# Altium project master-010106.PrjPcb (part 1 of 3)
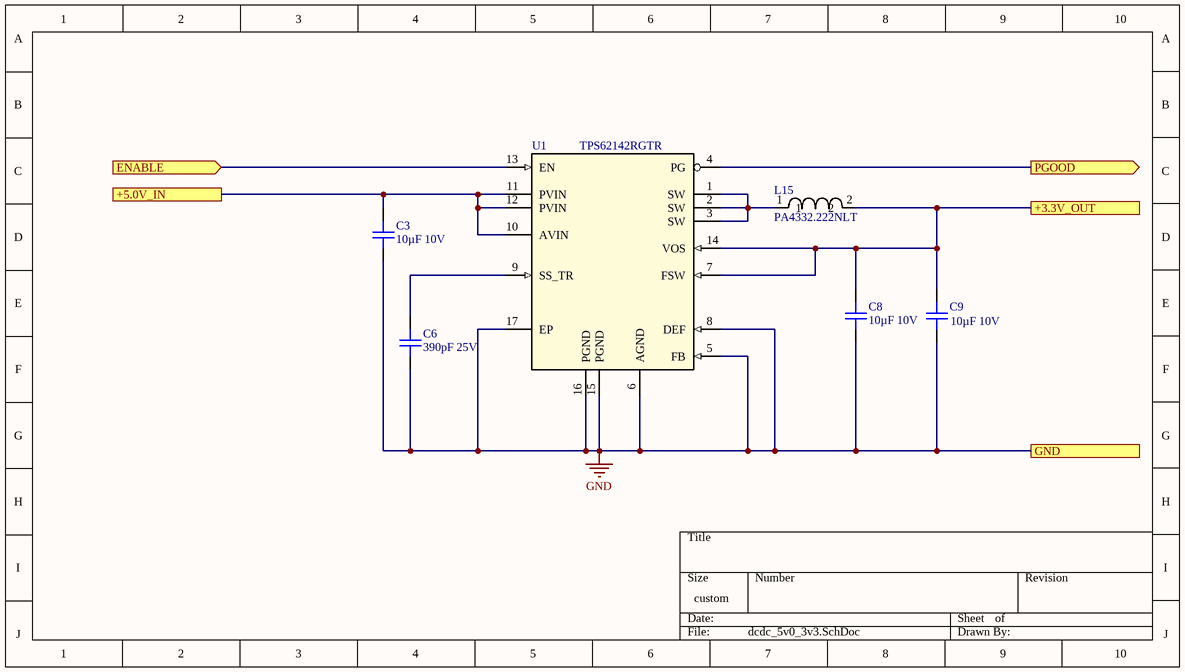
[diagram p0: dcdc_5v0_3v3.SchDoc]
GlobalDate: 2020-01-10; GlobalLicense: Creative Commons Attribution 4.0; GlobalProject: foxBMS BMS-master; GlobalVersion: 1.0.6-2
18 sheets, 274 parts. Net scope: hierarchical (ports join the sheet entries above them; power ports are global).
Board files: master.PcbDoc, master-1X1.PcbDoc
Sheets:
  dcdc_5v0_3v3.SchDoc
  hierarchy.SchDoc
    U_17_FPGA_SPI_interface = FPGA_SPI_interface.SchDoc
    U_04_mcu0_primary = mcu0_primary.SchDoc
      U_0404_debug_LED = debug_LED.SchDoc
      U_0405_ext_bootload_activation = ext_bootload_activation.SchDoc
      U_0400_power = power.SchDoc
    U_06_mcu0_to_mcu1_isolated_SPI = mcu0_to_mcu1_isolated_SPI.SchDoc
    U_13_isolated_USB = isolated_USB.SchDoc
    U_05_mcu1_secondary = mcu1_secondary.SchDoc
    U_18_connector_to_BMS_extension = connector_to_BMS_extension.SchDoc
    U_09_interlock_circuit = interlock_circuit.SchDoc
    U_10_contactor_control = contactor_control.SchDoc
    U_07_isolated_rs485 = isolated_rs485.SchDoc
  dcdc_wide_3v3.SchDoc
  bms-slave-magnetics.SchDoc
  0301_LTC6820_chip.SchDoc
  IsoDcDc-BSR033A.SchDoc

## Sheet dcdc_5v0_3v3.SchDoc
size 220 x 124 mm; SheetNumber: 1; SheetTotal: 1

### Parts
C3  10µF 10V  [0805C]
C6  390pF 25V  [0402C]
C8  10µF 10V  [0805C]
C9  10µF 10V  [0805C]
L15  PA4332.222NLT  [PA4332]
U1  TPS62142RGTR  [RGT0016C]

### Ports
+3.3V_OUT, +5.0V_IN, ENABLE (in), GND, PGOOD (out)

### Nets
GND: C3.2 C6.1 C8.2 C9.2 U1.5(FB) U1.6(AGND) U1.8(DEF) U1.15(PGND) U1.16(PGND) U1.17(EP) ; port GND
NetC3_1: C3.1 U1.10(AVIN) U1.11(PVIN) U1.12(PVIN) ; port +5.0V_IN
NetC6_2: C6.2 U1.9(SS_TR)
NetC8_1: C8.1 C9.1 L15.2 U1.7(FSW) U1.14(VOS) ; port +3.3V_OUT
NetL15_1: L15.1 U1.1(SW) U1.2(SW) U1.3(SW)
NetU1_4: U1.4(PG) ; port PGOOD
NetU1_13: U1.13(EN) ; port ENABLE

### Library data of the parts
C3 C8 C9 = gen_C_ceramic_10u_10V_X7R_0805: Ceramic, 10µF, ±10%, 10V, X7R, –55 to 125°C, 0805 (2012),RoHS, Automotive; Part Number: GCJ21BR71A106KE01; Manufacturer: Murata; Case EIA: 0805; Case Metric: 2012; Automotive Qualified: True; PnP Package: C_0805_10; PnP Value: 10µF/10V/X7R; Capacitance: 10µF; Dielectric: X7R; Rated Voltage: 10V; Height - Seated (Max): 1.25mm; Mounting Type: SurfaceMount,MLCC; Operating Temperature: –55 to 125°C; Series: GCJ; Tolerance: ±10%; Manufacturer_Part_Number: GCJ21BR71A106KE01; Supplier 1: Digi-Key; Supplier Part Number 1: 490-12646-1-ND
C6 = gen_C_ceramic_390p_25V_C0G_0402: Ceramic, 390pF, ±5%, 25V, C0G, 25 to 125°C, 0402 (1005),RoHS, Automotive; Part Number: GCM1555C1H180JA16#; Manufacturer: Murata; Capacitance: 18p; Rated Voltage: 50V; Case EIA: 0402; Case Metric: 1005; Automotive Qualified: True; PnP Package: C_0402_10; PnP Value: 18pF/50V/X7R; Dielectric: C0G; Supplier 1: Digi-Key; Supplier Part Number 1: 490-12650-1-ND; Height - Seated (Max): 0.5mm; Mounting Type: SurfaceMount,MLCC; Operating Temperature: 25 to 125°C; Series: GCM; Tolerance: ±5%; Manufacturer_Part_Number: GCM1555C1H180JA16#
L15 = PA4332.222NLT: Imported; Vendor: Pulse Engineering; Manufacturer_Part_Number: PA4332.222NLT; RefDes: RefDes; TYPE: TYPE; Value: Value
U1 = TPS62142RGTR: Imported; Manufacturer: Texas Instruments; PartNumber: TPS62142RGTR; RefDes: RefDes; TYPE: TYPE; Value: Value

## Sheet hierarchy.SchDoc
size A2; DocumentNumber: 1; SheetNumber: 1; SheetTotal: 24; SheetDescription: Structure of Master
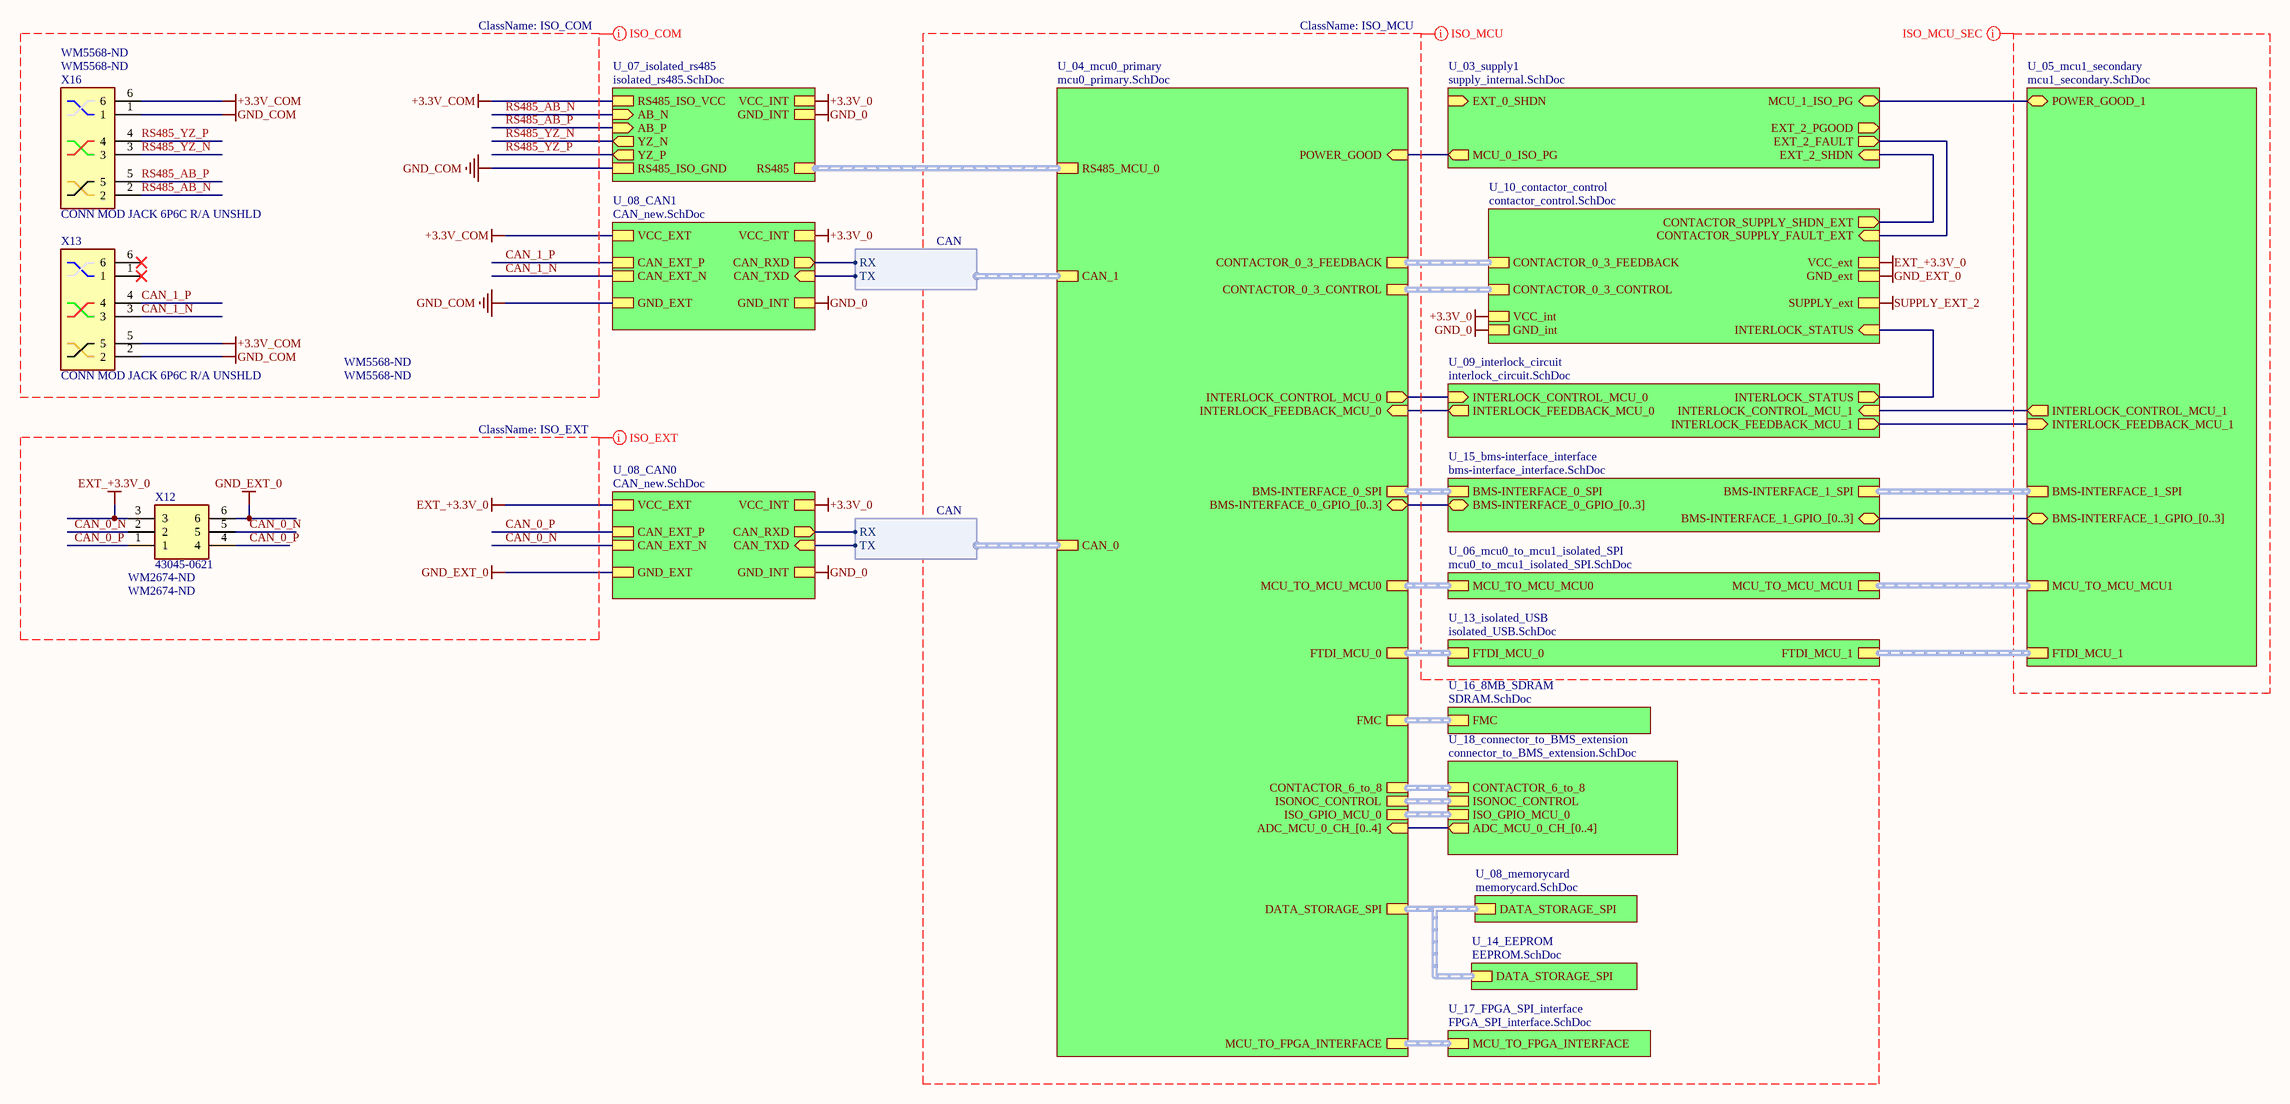
[diagram p1: hierarchy.SchDoc]

### Parts
X12  43045-0621  Supplier Part Number 1: WM2674-ND  [43045-0621]
X13  CONN MOD JACK 6P6C R/A UNSHLD  Supplier Part Number 1: WM5568-ND  [95501-2661]
X16  CONN MOD JACK 6P6C R/A UNSHLD  Supplier Part Number 1: WM5568-ND  [95501-2661]

### Sub-sheets
U_03_supply1 = supply_internal.SchDoc (file not in this document): EXT_2_FAULT (out), MCU_1_ISO_PG (bidir), EXT_0_SHDN (in), EXT_2_PGOOD (out), EXT_2_SHDN (in), MCU_0_ISO_PG (out)
U_04_mcu0_primary = mcu0_primary.SchDoc: MCU_TO_FPGA_INTERFACE (harness SPI), FMC (harness FMC), CAN_1 (harness CAN), CAN_0 (harness CAN), MCU_TO_MCU_MCU0 (harness SPI), FTDI_MCU_0 (harness FTDI), CONTACTOR_6_to_8 (harness CONTACTOR_6_to_8), INTERLOCK_FEEDBACK_MCU_0 (in), INTERLOCK_CONTROL_MCU_0 (out), DATA_STORAGE_SPI (harness DATA_STORAGE_SPI), CONTACTOR_0_3_CONTROL (harness CONTACTOR_0_TO_3), CONTACTOR_0_3_FEEDBACK (harness CONTACTOR_0_TO_3_FEEDBACK), BMS-INTERFACE_0_SPI (harness SPI), BMS-INTERFACE_0_GPIO_[0..3] (bidir, harness CAN), ADC_MCU_0_CH_[0..4] (in), RS485_MCU_0 (harness RS485), ISONOC_CONTROL (harness ISONOC_CONTROL), ISO_GPIO_MCU_0 (harness ISO_GPIO), POWER_GOOD (in)
U_05_mcu1_secondary = mcu1_secondary.SchDoc: INTERLOCK_FEEDBACK_MCU_1 (in), INTERLOCK_CONTROL_MCU_1 (out), FTDI_MCU_1 (harness FTDI), MCU_TO_MCU_MCU1 (harness SPI), BMS-INTERFACE_1_SPI (harness SPI), BMS-INTERFACE_1_GPIO_[0..3] (bidir), POWER_GOOD_1 (bidir)
U_06_mcu0_to_mcu1_isolated_SPI = mcu0_to_mcu1_isolated_SPI.SchDoc: MCU_TO_MCU_MCU0 (harness SPI), MCU_TO_MCU_MCU1 (harness SPI)
U_07_isolated_rs485 = isolated_rs485.SchDoc: RS485 (harness RS485), RS485_ISO_GND, RS485_ISO_VCC, YZ_P (out), AB_N (in), AB_P (in), YZ_N (out), VCC_INT, GND_INT
U_08_CAN0 = CAN_new.SchDoc (file not in this document): VCC_EXT, CAN_EXT_P, CAN_EXT_N, GND_EXT, CAN_TXD (in), CAN_RXD (out), GND_INT, VCC_INT
U_08_CAN1 = CAN_new.SchDoc (file not in this document): VCC_EXT, CAN_EXT_P, CAN_EXT_N, GND_EXT, CAN_TXD (in), CAN_RXD (out), GND_INT, VCC_INT
U_08_memorycard = memorycard.SchDoc (file not in this document): DATA_STORAGE_SPI (harness DATA_STORAGE_SPI)
U_09_interlock_circuit = interlock_circuit.SchDoc: INTERLOCK_CONTROL_MCU_1 (in), INTERLOCK_FEEDBACK_MCU_0 (out), INTERLOCK_FEEDBACK_MCU_1 (out), INTERLOCK_CONTROL_MCU_0 (in), INTERLOCK_STATUS (out)
U_10_contactor_control = contactor_control.SchDoc: SUPPLY_ext, GND_ext, GND_int, VCC_int, VCC_ext, CONTACTOR_0_3_CONTROL (harness CONTACTOR_0_TO_3), CONTACTOR_0_3_FEEDBACK (harness CONTACTOR_0_TO_3_FEEDBACK), CONTACTOR_SUPPLY_FAULT_EXT (in), CONTACTOR_SUPPLY_SHDN_EXT (out), INTERLOCK_STATUS (in)
U_13_isolated_USB = isolated_USB.SchDoc: FTDI_MCU_0 (harness FTDI), FTDI_MCU_1 (harness FTDI)
U_14_EEPROM = EEPROM.SchDoc (file not in this document): DATA_STORAGE_SPI (harness DATA_STORAGE_SPI)
U_15_bms-interface_interface = bms-interface_interface.SchDoc (file not in this document): BMS-INTERFACE_0_SPI (harness SPI), BMS-INTERFACE_1_SPI (harness SPI), BMS-INTERFACE_0_GPIO_[0..3] (bidir), BMS-INTERFACE_1_GPIO_[0..3] (bidir)
U_16_8MB_SDRAM = SDRAM.SchDoc (file not in this document): FMC (harness FMC)
U_17_FPGA_SPI_interface = FPGA_SPI_interface.SchDoc: MCU_TO_FPGA_INTERFACE (harness SPI)
U_18_connector_to_BMS_extension = connector_to_BMS_extension.SchDoc: CONTACTOR_6_to_8 (harness CONTACTOR_6_to_8), ADC_MCU_0_CH_[0..4] (out), ISONOC_CONTROL (harness ISONOC_CONTROL), ISO_GPIO_MCU_0 (harness ISO_GPIO)

### Harnesses
CAN: RX, TX

### Nets
+3.3V_0: sheet U_10_contactor_control/VCC_int, sheet U_07_isolated_rs485/VCC_INT, sheet U_08_CAN1/VCC_INT, sheet U_08_CAN0/VCC_INT
+3.3V_COM: X13.5 X16.6 ; sheet U_07_isolated_rs485/RS485_ISO_VCC, sheet U_08_CAN1/VCC_EXT
EXT_+3.3V_0: X12.3 ; sheet U_10_contactor_control/VCC_ext, sheet U_08_CAN0/VCC_EXT
GND_0: sheet U_10_contactor_control/GND_int, sheet U_07_isolated_rs485/GND_INT, sheet U_08_CAN1/GND_INT, sheet U_08_CAN0/GND_INT
GND_COM: X12.6 X13.2 X16.1 ; sheet U_10_contactor_control/GND_ext, sheet U_07_isolated_rs485/RS485_ISO_GND, sheet U_08_CAN1/GND_EXT, sheet U_08_CAN0/GND_EXT  [also labelled GND_EXT_0]
CAN_0_N: X12.2 X12.5 ; sheet U_08_CAN0/CAN_EXT_N
CAN_0_P: X12.1 X12.4 ; sheet U_08_CAN0/CAN_EXT_P
CAN_0_RX: sheet U_08_CAN0/CAN_RXD, sheet U_04_mcu0_primary/CAN_0.RX
CAN_0_TX: sheet U_08_CAN0/CAN_TXD, sheet U_04_mcu0_primary/CAN_0.TX
CAN_1_N: X13.3 ; sheet U_08_CAN1/CAN_EXT_N
CAN_1_P: X13.4 ; sheet U_08_CAN1/CAN_EXT_P
CAN_1_RX: sheet U_08_CAN1/CAN_RXD, sheet U_04_mcu0_primary/CAN_1.RX
CAN_1_TX: sheet U_08_CAN1/CAN_TXD, sheet U_04_mcu0_primary/CAN_1.TX
CONTACTOR_SUPPLY_FAULT_EXT: sheet U_03_supply1/EXT_2_FAULT, sheet U_10_contactor_control/CONTACTOR_SUPPLY_FAULT_EXT
CONTACTOR_SUPPLY_SHDN_EXT: sheet U_03_supply1/EXT_2_SHDN, sheet U_10_contactor_control/CONTACTOR_SUPPLY_SHDN_EXT
INTERLOCK_CONTROL_MCU_0: sheet U_04_mcu0_primary/INTERLOCK_CONTROL_MCU_0, sheet U_09_interlock_circuit/INTERLOCK_CONTROL_MCU_0
INTERLOCK_CONTROL_MCU_1: sheet U_05_mcu1_secondary/INTERLOCK_CONTROL_MCU_1, sheet U_09_interlock_circuit/INTERLOCK_CONTROL_MCU_1
INTERLOCK_FEEDBACK_MCU_0: sheet U_04_mcu0_primary/INTERLOCK_FEEDBACK_MCU_0, sheet U_09_interlock_circuit/INTERLOCK_FEEDBACK_MCU_0
INTERLOCK_FEEDBACK_MCU_1: sheet U_05_mcu1_secondary/INTERLOCK_FEEDBACK_MCU_1, sheet U_09_interlock_circuit/INTERLOCK_FEEDBACK_MCU_1
INTERLOCK_STATUS: sheet U_09_interlock_circuit/INTERLOCK_STATUS, sheet U_10_contactor_control/INTERLOCK_STATUS
MCU_0_NRESET: sheet U_03_supply1/MCU_0_ISO_PG, sheet U_04_mcu0_primary/POWER_GOOD
MCU_1_NRESET: sheet U_03_supply1/MCU_1_ISO_PG, sheet U_05_mcu1_secondary/POWER_GOOD_1
RS485_AB_N: X16.2 ; sheet U_07_isolated_rs485/AB_N  [project net ABEXT_N]
RS485_AB_P: X16.5 ; sheet U_07_isolated_rs485/AB_P  [project net ABEXT_P]
RS485_YZ_N: X16.3 ; sheet U_07_isolated_rs485/YZ_N
RS485_YZ_P: X16.4 ; sheet U_07_isolated_rs485/YZ_P

Not connected (* = marked no-connect by the designer): X13 1* 6*

### Buses and harness runs
bus sheet U_04_mcu0_primary/ADC_MCU_0_CH_[0..4] = sheet U_18_connector_to_BMS_extension/ADC_MCU_0_CH_[0..4]
bus sheet U_05_mcu1_secondary/BMS-INTERFACE_1_GPIO_[0..3] = sheet U_15_bms-interface_interface/BMS-INTERFACE_1_GPIO_[0..3]
harness sheet U_04_mcu0_primary/BMS-INTERFACE_0_SPI = sheet U_15_bms-interface_interface/BMS-INTERFACE_0_SPI
harness sheet U_04_mcu0_primary/CONTACTOR_0_3_CONTROL = sheet U_10_contactor_control/CONTACTOR_0_3_CONTROL
harness sheet U_04_mcu0_primary/CONTACTOR_0_3_FEEDBACK = sheet U_10_contactor_control/CONTACTOR_0_3_FEEDBACK
harness sheet U_04_mcu0_primary/CONTACTOR_6_to_8 = sheet U_18_connector_to_BMS_extension/CONTACTOR_6_to_8
harness sheet U_04_mcu0_primary/DATA_STORAGE_SPI = sheet U_08_memorycard/DATA_STORAGE_SPI = sheet U_14_EEPROM/DATA_STORAGE_SPI
harness sheet U_04_mcu0_primary/FMC = sheet U_16_8MB_SDRAM/FMC
harness sheet U_04_mcu0_primary/FTDI_MCU_0 = sheet U_13_isolated_USB/FTDI_MCU_0
harness sheet U_04_mcu0_primary/ISO_GPIO_MCU_0 = sheet U_18_connector_to_BMS_extension/ISO_GPIO_MCU_0
harness sheet U_04_mcu0_primary/ISONOC_CONTROL = sheet U_18_connector_to_BMS_extension/ISONOC_CONTROL
harness sheet U_04_mcu0_primary/MCU_TO_FPGA_INTERFACE = sheet U_17_FPGA_SPI_interface/MCU_TO_FPGA_INTERFACE
harness sheet U_04_mcu0_primary/MCU_TO_MCU_MCU0 = sheet U_06_mcu0_to_mcu1_isolated_SPI/MCU_TO_MCU_MCU0
harness sheet U_04_mcu0_primary/RS485_MCU_0 = sheet U_07_isolated_rs485/RS485
harness sheet U_05_mcu1_secondary/BMS-INTERFACE_1_SPI = sheet U_15_bms-interface_interface/BMS-INTERFACE_1_SPI
harness sheet U_05_mcu1_secondary/FTDI_MCU_1 = sheet U_13_isolated_USB/FTDI_MCU_1
harness sheet U_05_mcu1_secondary/MCU_TO_MCU_MCU1 = sheet U_06_mcu0_to_mcu1_isolated_SPI/MCU_TO_MCU_MCU1

### Layout directives
net class ISO_MCU: +3.3V_0, EXT_+3.3V_0, GND_0, GND_EXT_0, SUPPLY_EXT_2
net class ISO_MCU_SEC: (no net found under the mark)
net class ISO_COM: +3.3V_COM, CAN_1_N, CAN_1_P, GND_COM, RS485_AB_N, RS485_AB_P, RS485_YZ_N, RS485_YZ_P
net class ISO_EXT: CAN_0_N, CAN_0_P, EXT_+3.3V_0, GND_EXT_0

### Notes on the sheet
- Title
- Size:
- Date:
- File:
- A2
- Number:
- Time:
- Revision:
- Sheet
- of

### Library data of the parts
X12 = 43045-0621: Micro-Fit 3.0 Right Angle Header, 3.00mm Pitch, Dual Row, 6 Circuits, with Snap-in Plastic Peg PCB Lock, Tin, Glow Wire Capable, Black, 43045-0621; Manufacturer_Name: Molex; Part Name: MicroFit; Circuits: 6; Datasheet Link: http://www.molex.com/webdocs/datasheets/pdf/en-us//0430450621_PCB_HEADERS.pdf; Height: 8mm; Manufacturer_Part_Number: 43045-0621; Mouser Part Number: 538-43045-0621; Mouser Price/Stock: https://www.mouser.com/Search/Refine.aspx?Keyword=538-43045-0621; RS Part Number: 6700380; RS Price/Stock: https://uk.rs-online.com/web/p/products/6700380; Supplier 1: Digi-Key; Supplier 2: Digi-Key; Supplier Part Number 2: WM2674-ND
X13 X16 = 95501-2661: Jack Modular Connector 6p6c (RJ9, RJ10, RJ22) 90° Angle (Right) Unshielded Cat3; Manufacturer_Name: Molex; Manufacturer_Part_Number: 95501-2441; Allied_Number: 70372436; Datasheet Link: http://www.molex.com/webdocs/datasheets/pdf/en-us/0955012441_MODULAR_JACKS_PLUG.pdf; Mouser Part Number: 538-95501-2441; Mouser Price/Stock: https://www.mouser.com/Search/Refine.aspx?Keyword=538-95501-2441; RS Part Number: 2400913; RS Price/Stock: https://uk.rs-online.com/web/p/products/2400913; Allied Price/Stock: http://www.alliedelec.com/molex-incorporated-95501-2441/70372436/; Supplier 1: Digi-Key; Supplier 2: Digi-Key; Supplier Part Number 2: WM5568-ND

## Sheet FPGA_SPI_interface.SchDoc: foxBMS BMS-Master
size A3; DocumentNumber: 23; SheetNumber: 23; SheetTotal: 24; Author: Fraunhofer IISB foxBMS Team; REL-DATE: 2017-05-16; VERSION: 1.0.2; SheetDescription: FPGA SPI Interface up to 45MHz
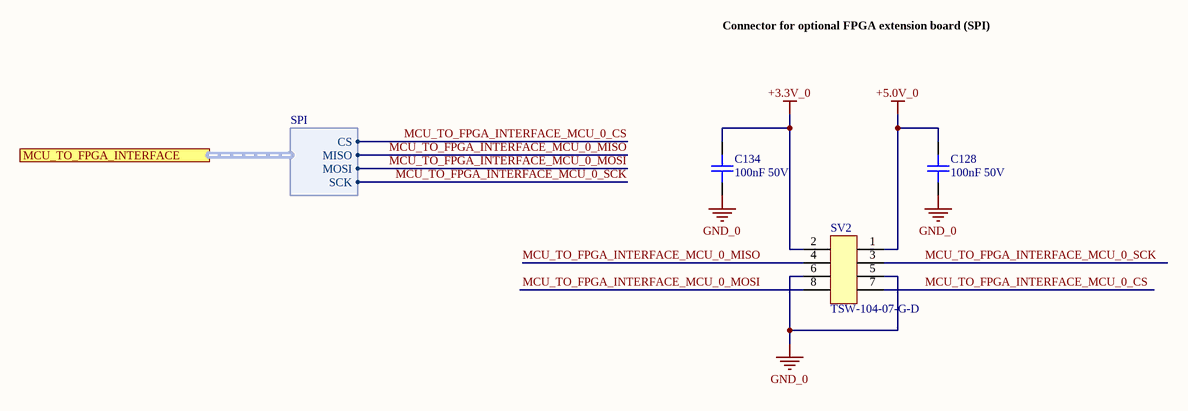
[diagram p2: FPGA_SPI_interface.SchDoc]

### Parts
C128  100nF 50V  [0603C]
C134  100nF 50V  [0603C]
SV2  TSW-104-07-G-D  [Pinheader_2.54_2x4]

### Ports
MCU_TO_FPGA_INTERFACE (harness SPI)

### Harnesses
SPI: CS, MISO, MOSI, SCK

### Nets
+3.3V_0: C134.2 SV2.2
+5.0V_0: C128.1 SV2.1
GND_0: C128.2 C134.1 SV2.5 SV2.6
MCU_TO_FPGA_INTERFACE_MCU_0_CS: SV2.7 ; port MCU_TO_FPGA_INTERFACE.CS
MCU_TO_FPGA_INTERFACE_MCU_0_MISO: SV2.4 ; port MCU_TO_FPGA_INTERFACE.MISO
MCU_TO_FPGA_INTERFACE_MCU_0_MOSI: SV2.8 ; port MCU_TO_FPGA_INTERFACE.MOSI
MCU_TO_FPGA_INTERFACE_MCU_0_SCK: SV2.3 ; port MCU_TO_FPGA_INTERFACE.SCK

### Notes on the sheet
- Connector for optional FPGA extension board (SPI)
- Fraunhofer IISB
- Schottkystr. 10
- developed by:
- 91058 Erlangen
- Germany
- Author
- Project
- License
- Description
- File
- Version
- Release Date
- Sheet
- www.foxbms.org
- www.iisb.fraunhofer.de
- foxBMS Team
- /

### Library data of the parts
C128 C134 = gen_C_ceramic_100n_50V_X7R_0603: Ceramic, 100nF, ±10%, 50V, X7R, –55 to 125°C, 0603 (1608),RoHS, Automotive; Part Number: GCJ188R71H104KA12; Manufacturer: Murata; Capacitance: 100n; Case EIA: 0603; Case Metric: 1608; PnP Package: C_0603_10; PnP Value: 100nF/50V/X7R; PnP equipped: x; Automotive Qualified: True; Rated Voltage: 50V; Dielectric: X7R; Supplier 1: Digi-Key; Supplier Part Number 1: 490-5798-1-ND; Height - Seated (Max): 0.8mm; Mounting Type: SurfaceMount,MLCC; Operating Temperature: –55 to 125°C; Series: GCJ; Tolerance: ±10%; Manufacturer_Part_Number: GCJ188R71H104KA12
SV2 = samtec_TSW-104-07-G-D: Board-To-Board Connector, Vertical, 2.54 mm, 8 Contacts, Header, TSW Series, Through Hole, 2 Rows; Manufacturer: Samtec; Circuits: 8; Rated Voltage: 500V AC mated with SSW; Automotive Qualified: False; Part Number: TSW-104-07-G-D; Part Name: TSW-104-07-G-D; Operating Temperature: -55°C - +125°C; ComponentLink1Description: Datasheet; ComponentLink1URL: http://www.farnell.com/datasheets/1992055.pdf; Supplier 1: Farnell; Supplier Part Number 1: 2025250; System: Connector

## Sheet mcu0_primary.SchDoc: foxBMS BMS-Master
size A3; DocumentNumber: 4; SheetNumber: 4; SheetTotal: 24; Author: Fraunhofer IISB foxBMS Team; REL-DATE: 2017-05-16; VERSION: 1.0.2; SheetDescription: MCU0 (Primary); ClassName: ISO_MCU
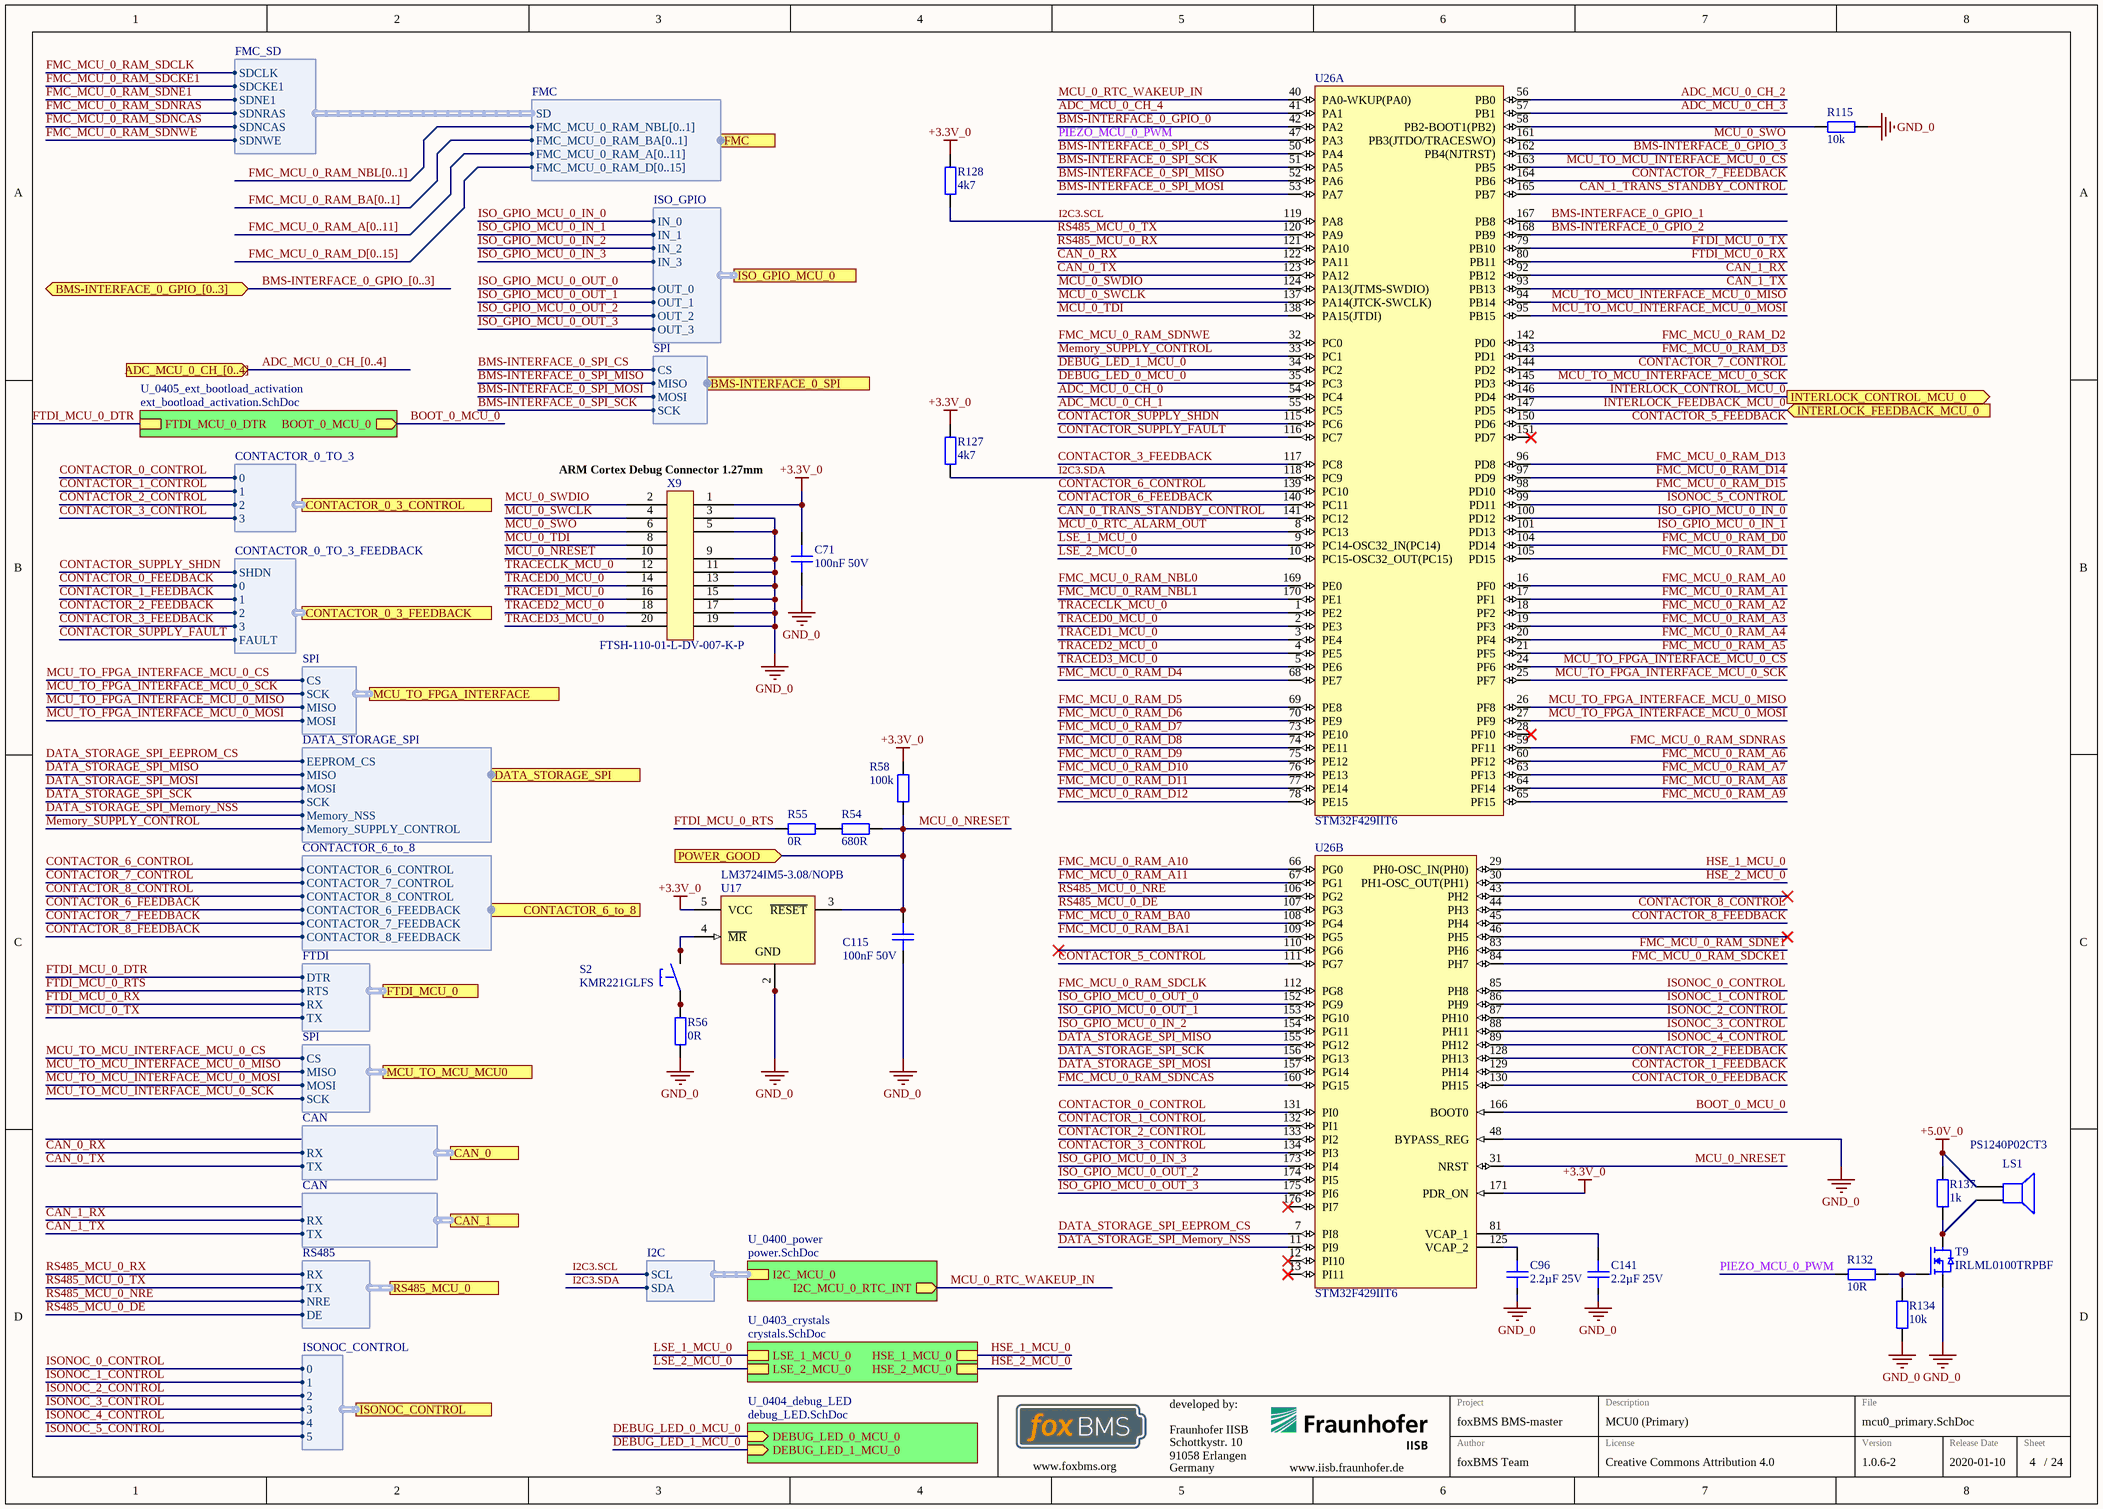
[diagram p3: mcu0_primary.SchDoc]

### Parts
C71  100nF 50V  [0603C]
C96  2.2µF 25V  [0805C]
C115  100nF 50V  [0603C]
C141  2.2µF 25V  [0805C]
LS1  PS1240P02CT3  [PS12]
R54  680R  [0603R]
R55  0R  [0603R]
R56  0R  [0603R]
R58  100k  [0603R]
R115  10k  [0603R]
R127  4k7  [0603R]
R128  4k7  [0603R]
R132  10R  [0603R]
R134  10k  [0603R]
R137  1k  [0603R]
S2  KMR221GLFS  [KMR2_Series]
T9  IRLML0100TRPBF  [SOT95P237X110-3N]
U17  LM3724IM5-3.08/NOPB  [MF05A_N]
U26  STM32F429IIT6  [STM-LQFP176_N]  (parts A,B of 3)
X9  FTSH-110-01-L-DV-007-K-P  [CORTEX_DEBUG_20_PIN]

### Sub-sheets
U_0400_power = power.SchDoc: I2C_MCU_0_RTC_INT (out), I2C_MCU_0 (harness I2C)
U_0403_crystals = crystals.SchDoc (file not in this document): LSE_1_MCU_0, LSE_2_MCU_0, HSE_1_MCU_0, HSE_2_MCU_0
U_0404_debug_LED = debug_LED.SchDoc: DEBUG_LED_0_MCU_0 (in), DEBUG_LED_1_MCU_0 (in)
U_0405_ext_bootload_activation = ext_bootload_activation.SchDoc: FTDI_MCU_0_DTR, BOOT_0_MCU_0 (out)

### Ports
ADC_MCU_0_CH_[0..4] (in), BMS-INTERFACE_0_GPIO_[0..3] (bidir, harness CAN), BMS-INTERFACE_0_SPI (harness SPI), CAN_0 (harness CAN), CAN_1 (harness CAN), CONTACTOR_0_3_CONTROL (harness CONTACTOR_0_TO_3), CONTACTOR_0_3_FEEDBACK (harness CONTACTOR_0_TO_3_FEEDBACK), CONTACTOR_6_to_8 (harness CONTACTOR_6_to_8), DATA_STORAGE_SPI (harness DATA_STORAGE_SPI), FMC (harness FMC), FTDI_MCU_0 (harness FTDI), INTERLOCK_CONTROL_MCU_0 (out), INTERLOCK_FEEDBACK_MCU_0 (in), ISO_GPIO_MCU_0 (harness ISO_GPIO), ISONOC_CONTROL (harness ISONOC_CONTROL), MCU_TO_FPGA_INTERFACE (harness SPI), MCU_TO_MCU_MCU0 (harness SPI), POWER_GOOD (in), RS485_MCU_0 (harness RS485)

### Harnesses
FMC_SD: SDCLK, SDCKE1, SDNE1, SDNRAS, SDNWE, SDNCAS
FMC: SD, FMC_MCU_0_RAM_NBL[0..1], FMC_MCU_0_RAM_BA[0..1], FMC_MCU_0_RAM_A[0..11], FMC_MCU_0_RAM_D[0..15]
SPI: CS, SCK, MISO, MOSI
DATA_STORAGE_SPI: EEPROM_CS, MISO, MOSI, SCK, Memory_NSS, Memory_SUPPLY_CONTROL
CONTACTOR_6_to_8: CONTACTOR_6_CONTROL, CONTACTOR_7_CONTROL, CONTACTOR_8_CONTROL, CONTACTOR_6_FEEDBACK, CONTACTOR_7_FEEDBACK, CONTACTOR_8_FEEDBACK
SPI: CS, MISO, MOSI, SCK
FTDI: DTR, RTS, RX, TX
CAN: RX, TX
RS485: RX, TX, NRE, DE
ISONOC_CONTROL: 0, 1, 2, 3, 4, 5
ISO_GPIO: IN_0, IN_1, IN_2, IN_3, OUT_3, OUT_0, OUT_1, OUT_2
CONTACTOR_0_TO_3: 0, 1, 2, 3
CONTACTOR_0_TO_3_FEEDBACK: 0, 1, 2, 3, FAULT, SHDN
I2C: SDA, SCL

### Nets
+3.3V_0: C71.1 R58.2 R127.2 R128.2 U17.5(VCC) U26.171(PDR_ON) X9.1
+5.0V_0: LS1.1 R137.2
GND_0: C71.2 C96.2 C115.2 C141.2 R56.1 R115.1 R134.1 T9.S U17.1(GND) U17.2(GND) U26.48(BYPASS_REG) X9.3 X9.5 X9.9 X9.11 X9.13 X9.15 X9.17 X9.19
ADC_MCU_0_CH_0: U26.54(PC4)
ADC_MCU_0_CH_1: U26.55(PC5)
ADC_MCU_0_CH_2: U26.56(PB0)
ADC_MCU_0_CH_3: U26.57(PB1)
ADC_MCU_0_CH_4: U26.41(PA1)
BMS-INTERFACE_0_GPIO_0: U26.42(PA2)
BMS-INTERFACE_0_GPIO_1: U26.167(PB8)
BMS-INTERFACE_0_GPIO_2: U26.168(PB9)
BMS-INTERFACE_0_GPIO_3: U26.162(PB4(NJTRST))
BMS-INTERFACE_0_SPI_CS: U26.50(PA4) ; port BMS-INTERFACE_0_SPI.CS
BMS-INTERFACE_0_SPI_MISO: U26.52(PA6) ; port BMS-INTERFACE_0_SPI.MISO
BMS-INTERFACE_0_SPI_MOSI: U26.53(PA7) ; port BMS-INTERFACE_0_SPI.MOSI
BMS-INTERFACE_0_SPI_SCK: U26.51(PA5) ; port BMS-INTERFACE_0_SPI.SCK
BOOT_0_MCU_0: U26.166(BOOT0) ; sheet U_0405_ext_bootload_activation/BOOT_0_MCU_0
CAN_0_RX: U26.122(PA11) ; port CAN_0.RX
CAN_0_TRANS_STANDBY_CONTROL: U26.141(PC12)
CAN_0_TX: U26.123(PA12) ; port CAN_0.TX
CAN_1_RX: U26.92(PB12) ; port CAN_1.RX
CAN_1_TRANS_STANDBY_CONTROL: U26.165(PB7)
CAN_1_TX: U26.93(PB13) ; port CAN_1.TX
CONTACTOR_0_CONTROL: U26.131(PI0) ; port CONTACTOR_0_3_CONTROL.0
CONTACTOR_0_FEEDBACK: U26.130(PH15) ; port CONTACTOR_0_3_FEEDBACK.0
CONTACTOR_1_CONTROL: U26.132(PI1) ; port CONTACTOR_0_3_CONTROL.1
CONTACTOR_1_FEEDBACK: U26.129(PH14) ; port CONTACTOR_0_3_FEEDBACK.1
CONTACTOR_2_CONTROL: U26.133(PI2) ; port CONTACTOR_0_3_CONTROL.2
CONTACTOR_2_FEEDBACK: U26.128(PH13) ; port CONTACTOR_0_3_FEEDBACK.2
CONTACTOR_3_CONTROL: U26.134(PI3) ; port CONTACTOR_0_3_CONTROL.3
CONTACTOR_3_FEEDBACK: U26.117(PC8) ; port CONTACTOR_0_3_FEEDBACK.3
CONTACTOR_5_CONTROL: U26.111(PG7)
CONTACTOR_5_FEEDBACK: U26.150(PD6)
CONTACTOR_6_CONTROL: U26.139(PC10) ; port CONTACTOR_6_to_8.CONTACTOR_6_CONTROL
CONTACTOR_6_FEEDBACK: U26.140(PC11) ; port CONTACTOR_6_to_8.CONTACTOR_6_FEEDBACK
CONTACTOR_7_CONTROL: U26.144(PD2) ; port CONTACTOR_6_to_8.CONTACTOR_7_CONTROL
CONTACTOR_7_FEEDBACK: U26.164(PB6) ; port CONTACTOR_6_to_8.CONTACTOR_7_FEEDBACK
CONTACTOR_8_CONTROL: U26.44(PH3) ; port CONTACTOR_6_to_8.CONTACTOR_8_CONTROL
CONTACTOR_8_FEEDBACK: U26.45(PH4) ; port CONTACTOR_6_to_8.CONTACTOR_8_FEEDBACK
CONTACTOR_SUPPLY_FAULT: U26.116(PC7) ; port CONTACTOR_0_3_FEEDBACK.FAULT
CONTACTOR_SUPPLY_SHDN: U26.115(PC6) ; port CONTACTOR_0_3_FEEDBACK.SHDN
DATA_STORAGE_SPI_EEPROM_CS: U26.7(PI8) ; port DATA_STORAGE_SPI.EEPROM_CS
DATA_STORAGE_SPI_Memory_NSS: U26.11(PI9) ; port DATA_STORAGE_SPI.Memory_NSS
DATA_STORAGE_SPI_MISO: U26.155(PG12) ; port DATA_STORAGE_SPI.MISO
DATA_STORAGE_SPI_MOSI: U26.157(PG14) ; port DATA_STORAGE_SPI.MOSI
DATA_STORAGE_SPI_SCK: U26.156(PG13) ; port DATA_STORAGE_SPI.SCK
DEBUG_LED_0_MCU_0: U26.35(PC3) ; sheet U_0404_debug_LED/DEBUG_LED_0_MCU_0
DEBUG_LED_1_MCU_0: U26.34(PC2) ; sheet U_0404_debug_LED/DEBUG_LED_1_MCU_0
FMC_MCU_0_RAM_A0: U26.16(PF0)
FMC_MCU_0_RAM_A1: U26.17(PF1)
FMC_MCU_0_RAM_A2: U26.18(PF2)
FMC_MCU_0_RAM_A3: U26.19(PF3)
FMC_MCU_0_RAM_A4: U26.20(PF4)
FMC_MCU_0_RAM_A5: U26.21(PF5)
FMC_MCU_0_RAM_A6: U26.60(PF12)
FMC_MCU_0_RAM_A7: U26.63(PF13)
FMC_MCU_0_RAM_A8: U26.64(PF14)
FMC_MCU_0_RAM_A9: U26.65(PF15)
FMC_MCU_0_RAM_A10: U26.66(PG0)
FMC_MCU_0_RAM_A11: U26.67(PG1)
FMC_MCU_0_RAM_BA0: U26.108(PG4)
FMC_MCU_0_RAM_BA1: U26.109(PG5)
FMC_MCU_0_RAM_D0: U26.104(PD14)
FMC_MCU_0_RAM_D1: U26.105(PD15)
FMC_MCU_0_RAM_D2: U26.142(PD0)
FMC_MCU_0_RAM_D3: U26.143(PD1)
FMC_MCU_0_RAM_D4: U26.68(PE7)
FMC_MCU_0_RAM_D5: U26.69(PE8)
FMC_MCU_0_RAM_D6: U26.70(PE9)
FMC_MCU_0_RAM_D7: U26.73(PE10)
FMC_MCU_0_RAM_D8: U26.74(PE11)
FMC_MCU_0_RAM_D9: U26.75(PE12)
FMC_MCU_0_RAM_D10: U26.76(PE13)
FMC_MCU_0_RAM_D11: U26.77(PE14)
FMC_MCU_0_RAM_D12: U26.78(PE15)
FMC_MCU_0_RAM_D13: U26.96(PD8)
FMC_MCU_0_RAM_D14: U26.97(PD9)
FMC_MCU_0_RAM_D15: U26.98(PD10)
FMC_MCU_0_RAM_NBL0: U26.169(PE0)
FMC_MCU_0_RAM_NBL1: U26.170(PE1)
FMC_MCU_0_RAM_SDCKE1: U26.84(PH7) ; harness FMC_SD.SDCKE1
FMC_MCU_0_RAM_SDCLK: U26.112(PG8) ; harness FMC_SD.SDCLK
FMC_MCU_0_RAM_SDNCAS: U26.160(PG15) ; harness FMC_SD.SDNCAS
FMC_MCU_0_RAM_SDNE1: U26.83(PH6) ; harness FMC_SD.SDNE1
FMC_MCU_0_RAM_SDNRAS: U26.59(PF11) ; harness FMC_SD.SDNRAS
FMC_MCU_0_RAM_SDNWE: U26.32(PC0) ; harness FMC_SD.SDNWE
FTDI_MCU_0_DTR: sheet U_0405_ext_bootload_activation/FTDI_MCU_0_DTR, port FTDI_MCU_0.DTR
FTDI_MCU_0_RTS: R55.2 ; port FTDI_MCU_0.RTS
FTDI_MCU_0_RX: U26.80(PB11) ; port FTDI_MCU_0.RX
FTDI_MCU_0_TX: U26.79(PB10) ; port FTDI_MCU_0.TX
HSE_1_MCU_0: U26.29(PH0-OSC_IN(PH0)) ; sheet U_0403_crystals/HSE_1_MCU_0
HSE_2_MCU_0: U26.30(PH1-OSC_OUT(PH1)) ; sheet U_0403_crystals/HSE_2_MCU_0
I2C3.SCL: R128.1 U26.119(PA8) ; sheet U_0400_power/I2C_MCU_0.SCL
I2C3.SDA: R127.1 U26.118(PC9) ; sheet U_0400_power/I2C_MCU_0.SDA
INTERLOCK_CONTROL_MCU_0: U26.146(PD4) ; port INTERLOCK_CONTROL_MCU_0
INTERLOCK_FEEDBACK_MCU_0: U26.147(PD5) ; port INTERLOCK_FEEDBACK_MCU_0
ISO_GPIO_MCU_0_IN_0: U26.100(PD12) ; port ISO_GPIO_MCU_0.IN_0
ISO_GPIO_MCU_0_IN_1: U26.101(PD13) ; port ISO_GPIO_MCU_0.IN_1
ISO_GPIO_MCU_0_IN_2: U26.154(PG11) ; port ISO_GPIO_MCU_0.IN_2
ISO_GPIO_MCU_0_IN_3: U26.173(PI4) ; port ISO_GPIO_MCU_0.IN_3
ISO_GPIO_MCU_0_OUT_0: U26.152(PG9) ; port ISO_GPIO_MCU_0.OUT_0
ISO_GPIO_MCU_0_OUT_1: U26.153(PG10) ; port ISO_GPIO_MCU_0.OUT_1
ISO_GPIO_MCU_0_OUT_2: U26.174(PI5) ; port ISO_GPIO_MCU_0.OUT_2
ISO_GPIO_MCU_0_OUT_3: U26.175(PI6) ; port ISO_GPIO_MCU_0.OUT_3
ISONOC_0_CONTROL: U26.85(PH8) ; port ISONOC_CONTROL.0
ISONOC_1_CONTROL: U26.86(PH9) ; port ISONOC_CONTROL.1
ISONOC_2_CONTROL: U26.87(PH10) ; port ISONOC_CONTROL.2
ISONOC_3_CONTROL: U26.88(PH11) ; port ISONOC_CONTROL.3
ISONOC_4_CONTROL: U26.89(PH12) ; port ISONOC_CONTROL.4
ISONOC_5_CONTROL: U26.99(PD11) ; port ISONOC_CONTROL.5
LSE_1_MCU_0: U26.9(PC14-OSC32_IN(PC14)) ; sheet U_0403_crystals/LSE_1_MCU_0
LSE_2_MCU_0: U26.10(PC15-OSC32_OUT(PC15)) ; sheet U_0403_crystals/LSE_2_MCU_0
MCU_0_NRESET: C115.1 R54.1 R58.1 U17.3(~{RESET}) U26.31(NRST) X9.10 ; port POWER_GOOD
MCU_0_RTC_ALARM_OUT: U26.8(PC13)
MCU_0_RTC_WAKEUP_IN: U26.40(PA0-WKUP(PA0)) ; sheet U_0400_power/I2C_MCU_0_RTC_INT  [project net GPIO.RTC_INT#]
MCU_0_SWCLK: U26.137(PA14(JTCK-SWCLK)) X9.4
MCU_0_SWDIO: U26.124(PA13(JTMS-SWDIO)) X9.2
MCU_0_SWO: U26.161(PB3(JTDO/TRACESWO)) X9.6
MCU_0_TDI: U26.138(PA15(JTDI)) X9.8
MCU_TO_FPGA_INTERFACE_MCU_0_CS: U26.24(PF6) ; port MCU_TO_FPGA_INTERFACE.CS
MCU_TO_FPGA_INTERFACE_MCU_0_MISO: U26.26(PF8) ; port MCU_TO_FPGA_INTERFACE.MISO
MCU_TO_FPGA_INTERFACE_MCU_0_MOSI: U26.27(PF9) ; port MCU_TO_FPGA_INTERFACE.MOSI
MCU_TO_FPGA_INTERFACE_MCU_0_SCK: U26.25(PF7) ; port MCU_TO_FPGA_INTERFACE.SCK
MCU_TO_MCU_INTERFACE_MCU_0_CS: U26.163(PB5) ; port MCU_TO_MCU_MCU0.CS
MCU_TO_MCU_INTERFACE_MCU_0_MISO: U26.94(PB14) ; port MCU_TO_MCU_MCU0.MISO
MCU_TO_MCU_INTERFACE_MCU_0_MOSI: U26.95(PB15) ; port MCU_TO_MCU_MCU0.MOSI
MCU_TO_MCU_INTERFACE_MCU_0_SCK: U26.145(PD3) ; port MCU_TO_MCU_MCU0.SCK
Memory_SUPPLY_CONTROL: U26.33(PC1) ; port DATA_STORAGE_SPI.Memory_SUPPLY_CONTROL
PIEZO_MCU_0_PWM: R132.2 U26.47(PA3)
RS485_MCU_0_DE: U26.107(PG3) ; port RS485_MCU_0.DE  [project net RS485_DE]
RS485_MCU_0_NRE: U26.106(PG2) ; port RS485_MCU_0.NRE
RS485_MCU_0_RX: U26.121(PA10) ; port RS485_MCU_0.RX
RS485_MCU_0_TX: U26.120(PA9) ; port RS485_MCU_0.TX
TRACECLK_MCU_0: U26.1(PE2) X9.12
TRACED0_MCU_0: U26.2(PE3) X9.14
TRACED1_MCU_0: U26.3(PE4) X9.16
TRACED2_MCU_0: U26.4(PE5) X9.18
TRACED3_MCU_0: U26.5(PE6) X9.20
NetC96_1: C96.1 U26.125(VCAP_2)
NetC141_1: C141.1 U26.81(VCAP_1)
NetLS1_2: LS1.2 R137.1 T9.D
NetR54_2: R54.2 R55.1
NetR56_2: R56.2 S2.1 S2.2
NetR115_2: R115.2 U26.58(PB2-BOOT1(PB2))
NetR132_1: R132.1 R134.2 T9.G
NetS2_3: S2.3 S2.4 U17.4(~{MR})

Not connected (* = marked no-connect by the designer): U26 12(PI10)* 13(PI11)* 28(PF10)* 43(PH2)* 46(PH5)* 110(PG6)* 151(PD7)* 176(PI7)*

### Buses and harness runs
bus ADC_MCU_0_CH_[0..4] = port ADC_MCU_0_CH_[0..4]
bus BMS-INTERFACE_0_GPIO_[0..3]
bus FMC_MCU_0_RAM_A[0..11]
bus FMC_MCU_0_RAM_BA[0..1]
bus FMC_MCU_0_RAM_D[0..15]
bus FMC_MCU_0_RAM_NBL[0..1]

### Notes on the sheet
- (near X9) ARM Cortex Debug Connector 1.27mm
- Fraunhofer IISB
- Schottkystr. 10
- developed by:
- 91058 Erlangen
- Germany
- Author
- Project
- License
- Description
- File
- Version
- Release Date
- Sheet
- www.foxbms.org
- www.iisb.fraunhofer.de
- foxBMS Team
- /

### Library data of the parts
C71 C115 = gen_C_ceramic_100n_50V_X7R_0603: as C128 on sheet FPGA_SPI_interface; Rated Voltage: 50V; Dielectric: X7R; Supplier 1: Digi-Key; Supplier Part Number 1: 490-5798-1-ND; Height - Seated (Max): 0.8mm; Mounting Type: SurfaceMount,MLCC; Operating Temperature: –55 to 125°C; Series: GCJ; Tolerance: ±10%; Manufacturer_Part_Number: GCJ188R71H104KA12
C96 C141 = gen_C_ceramic_2u2_50V_X7R_0805: Ceramic, 2.2µF, ±10%, 25V, X7R, –55 to 125°C, 0805 (2012),RoHS, Automotive; Part Number: GCJ21BR71E225KA01; Manufacturer: Murata; Capacitance: 2u2; Case EIA: 0805; Case Metric: 2012; Automotive Qualified: True; PnP Package: C_0805_10; PnP Value: 2.2µF/25V/X7R; Rated Voltage: 25V; Dielectric: X7R; Height - Seated (Max): 1.25mm; Mounting Type: SurfaceMount,MLCC; Operating Temperature: –55 to 125°C; Series: GCJ; Tolerance: ±10%; Manufacturer_Part_Number: GCJ21BR71E225KA01
LS1 = Speaker: Loudspeaker; ID: 17009; DBDesc: BUZZER PIEZO 4KHZ 12.2MM PC MNT, RoHS compliant
R54 = gen_R_680R_0603: SMD Resistor 680R 0603; Tolerance: 1%; Power: 0.1W; Case EIA: 0603; Case Metric: 1608; Maximum Working Voltage: 75V; PnP Package: R_0603; Automotive Qualified: False; Part Number: gen_R_680R_0603; Operating Temperature: -55°C - +155°C; Resistance: 680R; Series: E24; PnP Value: 680R; Supplier 1: Farnell; Supplier Part Number 1: 2797303
R55 R56 = gen_R_0R_0603: SMD Resistor 0R 0603; Power: 0.1W; Case EIA: 0603; Case Metric: 1608; PnP Package: R_0603; Maximum Working Voltage: 75V; Automotive Qualified: False; Part Number: gen_R_0R_0603; Operating Temperature: -55°C - +155°C; Resistance: 0R; Series: Jumper; PnP Value: 0R; Supplier 1: Farnell; Supplier Part Number 1: 2073345
R58 = gen_R_100k_0603: SMD Resistor 100k 0603; Case EIA: 0603; Case Metric: 1608; PnP Package: R_0603; Automotive Qualified: False; Part Number: gen_R_100k_0603; Operating Temperature: -55°C - +155°C; PnP Value: 100k
R115 R134 = gen_R_10k_0603: SMD Resistor 10k 0603; Tolerance: 1%; Power: 0.1W; Case EIA: 0603; Case Metric: 1608; Maximum Working Voltage: 75V; PnP Package: R_0603; Automotive Qualified: False; Part Number: gen_R_10k_0603; Operating Temperature: -55°C - +155°C; Resistance: 10k; Series: E24, E96; PnP Value: 10k; Supplier 1: Farnell; Supplier Part Number 1: 2073349
R127 R128 = gen_R_4K7_0603: SMD Resistor 4.7k 0603; Case EIA: 0603; Case Metric: 1608; PnP Package: R_0603; Automotive Qualified: False; PnP Value: 4k7; Operating Temperature: -55°C - +155°C; Part Number: gen_R_4k7_0603
R132 = gen_R_10R_0603: SMD Resistor 10R 0603; Tolerance: 1%; Power: 0.1W; Case EIA: 0603; Case Metric: 1608; Maximum Working Voltage: 75V; PnP Package: R_0603; Automotive Qualified: False; Part Number: gen_R_10R_0603; Operating Temperature: -55°C - +155°C; Resistance: 10R; Series: E24, E96; PnP Value: 10R; Supplier 1: Farnell; Supplier Part Number 1: 2073361
R137 = gen_R_10k_0603: SMD Resistor 1k 0603; Part Number: gen_R_1k_0603; Tolerance: 1%; Power: 0.1W; Case EIA: 0603; Case Metric: 1608; Maximum Working Voltage: 75V; PnP Package: R_0603; Automotive Qualified: False; Operating Temperature: -55°C - +155°C; Resistance: 1k; Series: E24, E96; PnP Value: 1k
S2 = KMR221GLFS: Microminiature Tactile Switch; Manufacturer: CK Components; Automotive Qualified: False; Part Number: KMR221GLFS; Operating Temperature: -40°C - +85°C; ComponentLink1Description: Datasheet; ComponentLink1URL: http://www.farnell.com/datasheets/1685525.pdf; Supplier 1: Farnell; Supplier Part Number 1: 1201424; Supplier 2: Digikey; Supplier Part Number 2: 401-1426-1-ND; Supplier 3: Mouser; Supplier Part Number 3: 611-KMR211G-LFS
T9 = IRLML0100TRPBF: MOSFET-Transistor, n-Kanal, 1.6 A, 100 V, 0.178 ohm, 10 V, 2.5 V; Manufacturer: Infineon; Maximum Drain-Source Voltage: 100V; Maximum Continous Drain Current (25°C): 1.6A; R_DS(on): 190m; Total Gate Charge: 2.5nC; Automotive Qualified: False; Part Number: IRLML0100TRPBF; Part Name: NMOS; Operating Temperature: -55°C - +150°C; ComponentLink1Description: Datasheet URL; ComponentLink1URL: http://www.farnell.com/datasheets/491501.pdf; Supplier 1: Farnell; Supplier Part Number 1: 1783928
U17 = CMP-0063-01088-2: 5-Pin Microprocessor Reset Circuits, 5-pin SOT-23, Pb-Free; Manufacturer: National Semiconductor; PowerWise: N; PackageTopMarking: R53B*XTT; CompType: MiscPower; PackageVersion: revD, Aug-2008; ComponentLink3URL: http://www.national.com/packaging/folders/mf05a.html; ComponentLink2URL: http://www.national.com/pf/LM/LM3724.html; PinCount: 5; ComponentLink2Description: LM3724 Web Page; PackageDescription: Molded SOT-23, .115 x .063 x .040 in Body, 5 Lead, .0375 in Pitch; ComponentLink3Description: MF05A Package Page; ComponentLink1Description: LM3724 Datasheet; RevisionNote: Component URLs added; RoHS: Y; ComponentLink1URL: http://www.national.com/ds/LM/LM3724.pdf; DatasheetVersion: Jul-2007; PackageReference: MF05A
U26 = MC-ARM-STM32F4X9-SQ176: ARM Cortex-M4 32-bit MCU+FPU, 225 DMIPS, 2048 kB Flash, 256 kB Internal RAM, 140 I/Os, 176-pin LQFP, -40 to 85 degC, Tray; Manufacturer: STMicroelectronics; Internal RAM Size (kB): 256; I/Os (High Current): 140; FLASH Size (Prog) (kB): 2048; D/A Converter: 2x12-bit; Supply Voltage(Vcc) max (V): 3.6; Operating Frequency(F) (Processor speed) (MHz): 180; Supply Voltage(Vcc) min (V): 1.8; Core: ARM Cortex-M4; PackageReference: LQFP176; ComponentLink1Description: Manufacturer URL; Packing: Tray; ComponentLink2Description: Datasheet; ComponentLink3Description: Package Specification; ComponentLink2URL: http://www.st.com/st-web-ui/static/active/en/resource/technical/document/data_brief/DM00053488.pdf; PackageVersion: Rev. 4, 06/2013; ComponentLink1URL: http://www.st.com/web/en/home.html; DatasheetVersion: Rev. 2; PartNumber: STM32F429IIT6; PackageDescription: 176-Pin Low Profile Quad Flat Package, 24 x 24 mm Body, 0.5 mm Pitch; ComponentLink3URL: http://www.st.com/st-web-ui/static/active/en/resource/technical/document/datasheet/DM00035129.pdf; Mounting Technology: Surface Mount; Part Number: STM32F429IIT6
X9 = samtec_FTSH-110-01-L-DV-007-K-P: Board-To-Board Connector, ARM Cortex Debug Header 20 Pin; Manufacturer: Samtec; Circuits: 20; Automotive Qualified: False; Part Number: samtec_FTSH-110-01-L-DV-007-K-P; Part Name: FTSH-110-01-L-DV-007-K-P; Operating Temperature: -55°C - +125°C; Supplier 1: Digikey; Supplier Part Number 1: SAM11268-ND; Supplier 2: Avnet; Supplier Part Number 2: FTSH-110-01-L-DV-007-K-P

## Sheet debug_LED.SchDoc
size A3; DocumentNumber: 9; SheetNumber: 9; SheetTotal: 24; SheetDescription: Debug LEDs for MCU0
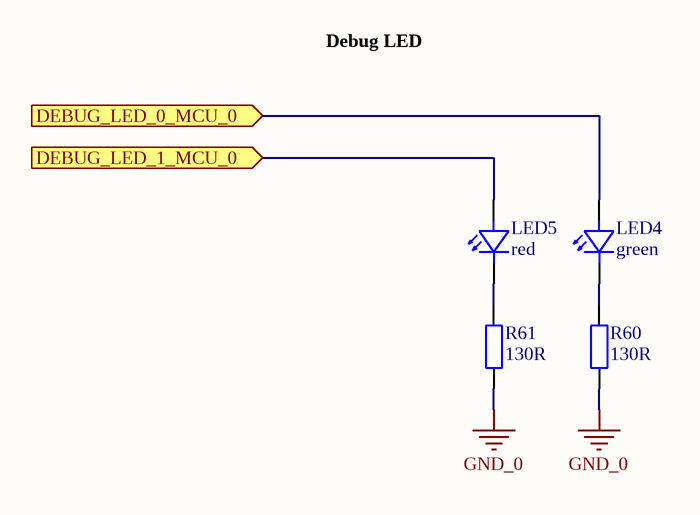
[diagram p4: debug_LED.SchDoc]

### Parts
LED4  green  [LEDC1608X07N]
LED5  red  [LEDC1608X07N]
R60  130R  [0603R]
R61  130R  [0603R]

### Ports
DEBUG_LED_0_MCU_0 (in), DEBUG_LED_1_MCU_0 (in)

### Nets
GND_0: R60.1 R61.1
DEBUG_LED_0_MCU_0: LED4.2(A) ; port DEBUG_LED_0_MCU_0
DEBUG_LED_1_MCU_0: LED5.2(A) ; port DEBUG_LED_1_MCU_0
NetLED4_1: LED4.1(C) R60.2
NetLED5_1: LED5.1(C) R61.2

### Notes on the sheet
- Debug LED
- Fraunhofer IISB
- Schottkystr. 10
- developed by:
- 91058 Erlangen
- Germany
- Author
- Project
- License
- Description
- File
- Version
- Release Date
- Sheet
- www.foxbms.org
- www.iisb.fraunhofer.de
- foxBMS Team
- /

### Library data of the parts
LED4 = gen_LED_0603_green: LED; Breakdown Voltage: 5V; Continuous Forward Current: 20mA; Forward Voltage @ 20mA: 2.2V; Automotive Qualified: False; Case EIA: 0603; Case Metric: 1608; Part Number: gen_LED_0603_green; Color: green; PnP Package: LED_0603; Supplier 1: Farnell; Supplier Part Number 1: 2099223
LED5 = gen_LED_0603_red: LED; Breakdown Voltage: 5V; Continuous Forward Current: 20mA; Forward Voltage @ 20mA: 2V; Automotive Qualified: False; Case EIA: 0603; Case Metric: 1608; Part Number: gen_LED_0603_red; Color: red; PnP Package: LED_0603; Supplier 1: Farnell; Supplier Part Number 1: 2099221
R60 R61 = gen_R_130R_0603: SMD Resistor 130R 0603; Tolerance: 1%; Power: 0.1W; Case EIA: 0603; Case Metric: 1608; Maximum Working Voltage: 75V; PnP Package: R_0603; Automotive Qualified: False; Part Number: gen_R_130R_0603; Operating Temperature: -55°C - +155°C; Resistance: 130R; Series: E24, E96; PnP Value: 130R; Supplier 1: Farnell; Supplier Part Number 1: 2379959

## Sheet ext_bootload_activation.SchDoc
size A3; DocumentNumber: 10; SheetNumber: 10; SheetTotal: 24; SheetDescription: External Bootload Activation Circuit
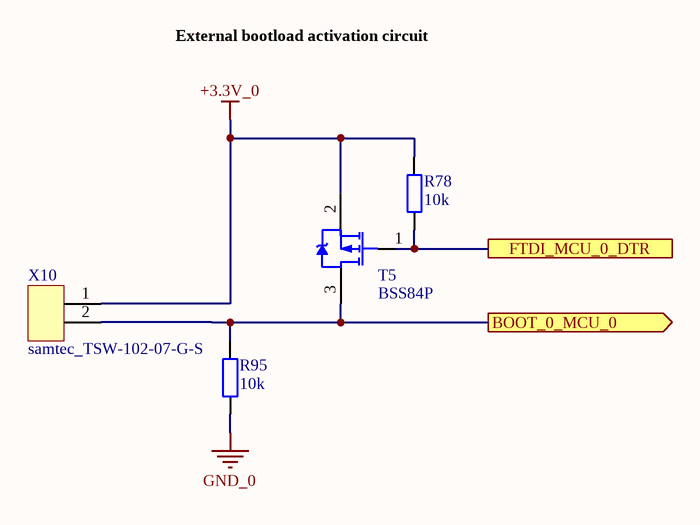
[diagram p5: ext_bootload_activation.SchDoc]

### Parts
R78  10k  [0603R]
R95  10k  [0603R]
T5  BSS84P  [INF-PG-SOT23_N]
X10  samtec_TSW-102-07-G-S  [Pinheader_2.54_2]

### Ports
BOOT_0_MCU_0 (out), FTDI_MCU_0_DTR

### Nets
+3.3V_0: R78.2 T5.2(SOURCE) X10.1
GND_0: R95.1
BOOT_0_MCU_0: R95.2 T5.3(DRAIN) X10.2 ; port BOOT_0_MCU_0
FTDI_MCU_0_DTR: R78.1 T5.1(GATE) ; port FTDI_MCU_0_DTR

### Notes on the sheet
- External bootload activation circuit
- Fraunhofer IISB
- Schottkystr. 10
- developed by:
- 91058 Erlangen
- Germany
- Author
- Project
- License
- Description
- File
- Version
- Release Date
- Sheet
- www.foxbms.org
- www.iisb.fraunhofer.de
- foxBMS Team
- /

### Library data of the parts
R78 R95 = gen_R_10k_0603: as R115 on sheet mcu0_primary; Part Number: gen_R_10k_0603; Operating Temperature: -55°C - +155°C; Resistance: 10k; Series: E24, E96; PnP Value: 10k; Supplier 1: Farnell; Supplier Part Number 1: 2073349
T5 = CMP-1099-00028-1: P-Channel SIPMOS Small-Signal-Transistor, -60 V VDS, -0.17 A ID, -55 to 150 degC, PG-SOT23, Reel, Green; Manufacturer: Infineon; VGS(th) (max): -2Â V; VGS(th) (min): -1Â V; VDS (max): -60Â V; Rth: 350Â K/W; Pto t (max): 0.36Â W; ID (max): -0.17Â A; IDpuls (max): -0.68Â A; RDS (on) (max) (@4.5V): 12,000Â mOhm; QG: 1Â nC; Green: TRUE; RDS (on) (max): 8,000Â mOhm; ComponentLink3URL: http://www.infineon.com/dgdl/SOT23-Package_Overview.pdf?folderId=db3a30431936bc4b0119532290053c66&fileId=db3a30431936bc4b0119533468123c85; ComponentLink3Description: Package Specification; Packing: Reel; PartNumber: BSS84P; ComponentLink2Description: Datasheet; Mounting Technology: Surface Mount; ComponentLink2URL: http://www.infineon.com/dgdl/BSS84P_Rev2.7%5B1%5D.pdf?folderId=db3a304314dca38901154a72e3951a65&fileId=db3a304330f68606013118ac7a9b4549; PackageReference: PG-SOT23; ComponentLink1URL: http://www.infineon.com/; PackageVersion: Apr-08; ComponentLink1Description: Manufacturer URL; PackageDescription: 3-Pin Small Outline Transistor Package, 2.9 x 1.3 mm Body, 0.95 mm Pitch; Halogen-free: TRUE; DatasheetVersion: Rev. 2.7
X10 = samtec_TSW-102-07-G-S: Board-To-Board Connector, Vertical, 2.54 mm, 2 Contacts, Header, TSW Series, Through Hole, 1 Row; Manufacturer: Samtec; Circuits: 2; Automotive Qualified: False; Part Number: samtec_TSW-102-07-G-S; Part Name: TSW-102-07-G-S; Operating Temperature: -55°C - +125°C; ComponentLink1Description: Datasheet; ComponentLink1URL: http://www.farnell.com/datasheets/1796313.pdf; Supplier 1: Farnell; Supplier Part Number 1: 2505044

## Sheet power.SchDoc
size A4; DocumentNumber: 5; SheetNumber: 5; SheetTotal: 24; SheetDescription: Decoupling and references for MCU0; ClassName: ISO_MCU
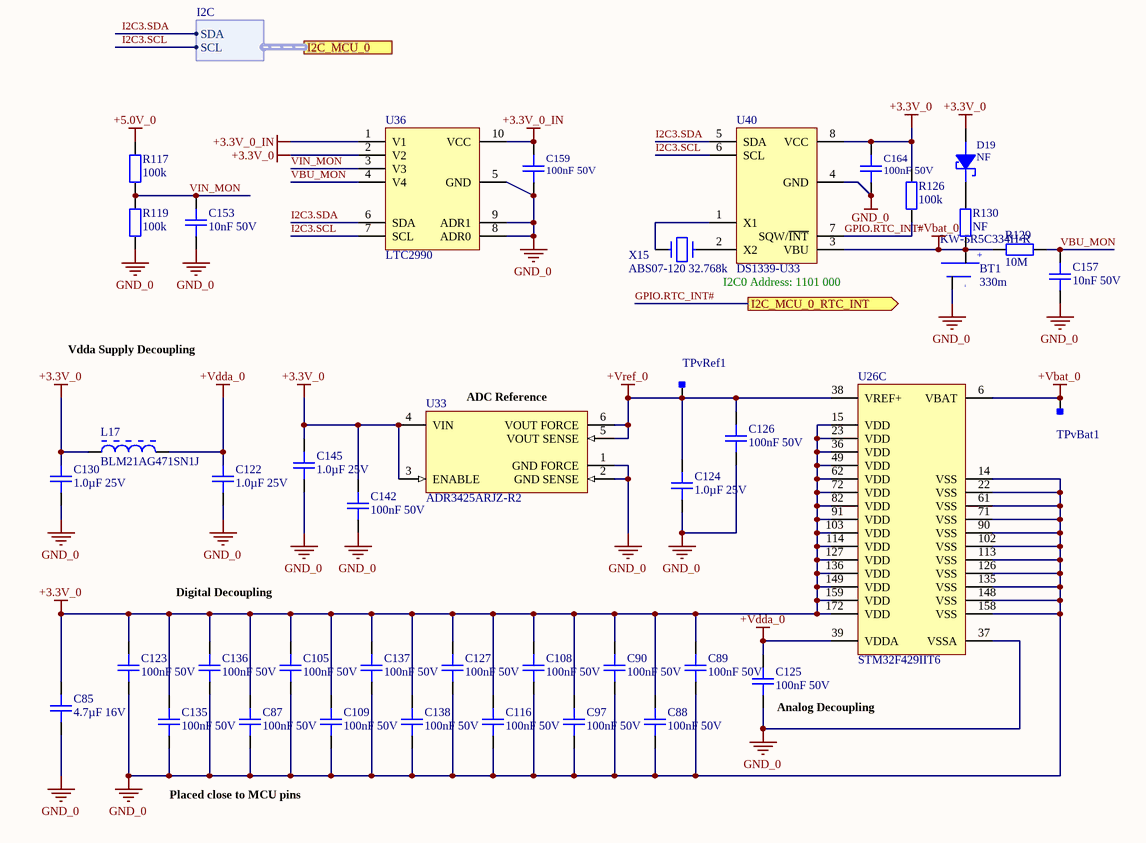
[diagram p6: power.SchDoc]

### Parts
BT1  330m  Supplier Part Number 1: KW-5R5C334H-R  [KW-5R5C]
C85  4.7µF 16V  [0805C]
C87  100nF 50V  [0402C]
C88  100nF 50V  [0402C]
C89  100nF 50V  [0402C]
C90  100nF 50V  [0402C]
C97  100nF 50V  [0402C]
C105  100nF 50V  [0402C]
C108  100nF 50V  [0402C]
C109  100nF 50V  [0402C]
C116  100nF 50V  [0402C]
C122  1.0µF 25V  [0603C]
C123  100nF 50V  [0402C]
C124  1.0µF 25V  [0603C]
C125  100nF 50V  [0402C]
C126  100nF 50V  [0402C]
C127  100nF 50V  [0402C]
C130  1.0µF 25V  [0603C]
C135  100nF 50V  [0402C]
C136  100nF 50V  [0402C]
C137  100nF 50V  [0402C]
C138  100nF 50V  [0402C]
C142  100nF 50V  [0603C]
C145  1.0µF 25V  [0603C]
C153  10nF 50V  [0603C]
C157  10nF 50V  [0603C]
C159  100nF 50V  [0603C]
C164  100nF 50V  [0603C]
D19  NF  [NF_SOD-523]
L17  BLM21AG471SN1J  [MURA-BLM21-H1-CHIP-2_V]
R117  100k  [0603R]
R119  100k  [0603R]
R126  100k  [0603R]
R129  10M  [0603R]
R130  NF  [0603R]
TPvBat1  Testpoint_Square  [Testpoint_S1]  (value not drawn)  (no BOM)
TPvRef1  Testpoint_Square  [Testpoint_S1]  (value not drawn)  (no BOM)
U26  STM32F429IIT6  [STM-LQFP176_N]  (part C of 3)
U33  ADR3425ARJZ-R2  [ADI-RJ-6_N]
U36  LTC2990  [MSOP-10]
U40  DS1339-U33  [USOP-8]
X15  ABS07-120 32.768k  [ABS07]

### Ports
I2C_MCU_0 (harness I2C), I2C_MCU_0_RTC_INT (out)

### Harnesses
I2C: SDA, SCL

### Nets
+3.3V_0: C85.1 C87.1 C88.1 C89.1 C90.1 C97.1 C105.1 C108.1 C109.1 C116.1 C123.1 C127.1 C130.1 C135.1 C136.1 C137.1 C138.1 C142.1 C145.1 C164.1 D19.1(A) L17.1 R126.2 U26.15(VDD) U26.23(VDD) U26.36(VDD) U26.49(VDD) U26.62(VDD) U26.72(VDD) U26.82(VDD) U26.91(VDD) U26.103(VDD) U26.114(VDD) U26.127(VDD) U26.136(VDD) U26.149(VDD) U26.159(VDD) U26.172(VDD) U33.3(ENABLE) U33.4(VIN) U36.2(V2) U40.8(VCC)
+3.3V_0_IN: C159.1 U36.1(V1) U36.10(VCC)
+5.0V_0: R117.2
+Vbat_0: BT1.1(pos1) R129.2 R130.2 TPvBat1.1 U26.6(VBAT) U40.3(VBU)
+Vdda_0: C122.1 C125.1 L17.2 U26.39(VDDA)
+Vref_0: C124.1 C126.1 TPvRef1.1 U26.38(VREF+) U33.5(VOUT_SENSE) U33.6(VOUT_FORCE)
GND_0: BT1.2(neg) C85.2 C87.2 C88.2 C89.2 C90.2 C97.2 C105.2 C108.2 C109.2 C116.2 C122.2 C123.2 C124.2 C125.2 C126.2 C127.2 C130.2 C135.2 C136.2 C137.2 C138.2 C142.2 C145.2 C153.1 C157.1 C159.2 C164.2 R119.1 U26.14(VSS) U26.22(VSS) U26.37(VSSA) U26.61(VSS) U26.71(VSS) U26.90(VSS) U26.102(VSS) U26.113(VSS) U26.126(VSS) U26.135(VSS) U26.148(VSS) U26.158(VSS) U33.1(GND_FORCE) U33.2(GND_SENSE) U36.5(GND) U36.8(ADR0) U36.9(ADR1) U40.4(GND)
GPIO.RTC_INT#: R126.1 U40.7(SQW/~{INT}) ; port I2C_MCU_0_RTC_INT
I2C3.SCL: U36.7(SCL) U40.6(SCL) ; port I2C_MCU_0.SCL
I2C3.SDA: U36.6(SDA) U40.5(SDA) ; port I2C_MCU_0.SDA
VBU_MON: C157.2 R129.1 U36.4(V4)
VIN_MON: C153.2 R117.1 R119.2 U36.3(V3)
NetD19_2: D19.2(C) R130.1
NetU40_1: U40.1(X1) X15.2
NetU40_2: U40.2(X2) X15.1

### Notes on the sheet
- I2C0 Address: 1101 000
- Vdda Supply Decoupling
- (near U33) ADC Reference
- Digital Decoupling
- (near C125) Analog Decoupling
- Placed close to MCU pins
- Title
- Size:
- Date:
- Tabloid
- Number:
- Time:
- Revision:
- Sheet
- of
- File:
- (in symbol BATTERY_1) +; -

### Library data of the parts
BT1 = BATTERY_1: Eaton 330mF, 5.5v, -20 to +80, Ultracapacitor, KW-5R5C334H-R; Manufacturer 1: Eaton - Electronics Division; DBDesc: 330m 5.5V super capacitor -40-+85degC 13.5mm 8.5mm tall, RoHS compliant (DUPLICATE OF ID#22645); ID: 27713; Capacitance: 330mF; Manufacturer Part Number 1: KW-5R5C334H-R; Supplier 1: Avnet; Stock 1: 0; Pricing 1: 400=2.49000, 800=2.39000, 1600=2.29000, 2400=2.29000, 4000=2.19000 (USD); RoHS: No
C85 = gen_C_ceramic_4u7_16V_X7R_0805: Ceramic, 4.7µF, ±10%, 16V, X7R, –55 to 125°C, 0805 (2012),RoHS, Automotive; Part Number: GCJ21BR71C475KA01; Manufacturer: Murata; Capacitance: 4u7; Case EIA: 0805; Case Metric: 2012; AVT Set: x; Automotive Qualified: True; PnP Package: C_0805_10; PnP Value: 4.7µF/16V/X7R; Rated Voltage: 16V; Dielectric: X7R; Supplier 1: Digi-Key; Supplier Part Number 1: 490-10557-1-ND; Height - Seated (Max): 1.25mm; Mounting Type: SurfaceMount,MLCC; Operating Temperature: –55 to 125°C; Series: GCJ; Tolerance: ±10%; Manufacturer_Part_Number: GCJ21BR71C475KA01
C87-C90 C97 C105 C108 C109 C116 C123 C125-C127 C135-C138 = gen_C_ceramic_100n_50V_X7R_0402: Ceramic, 100nF, ±10%, 50V, X7R, –55 to 125°C, 0402 (1005),RoHS, Automotive; Part Number: GCM155R71H104KE02; Manufacturer: Murata; Capacitance: 100n; Case EIA: 0402; Case Metric: 1005; PnP Package: C_0402_10; PnP Value: 100nF/50V/X7R; Automotive Qualified: True; PnP equipped: x; Rated Voltage: 50V; Dielectric: X7R; Supplier 1: Digi-Key; Supplier Part Number 1: 490-10672-1-ND; Height - Seated (Max): 0.5mm; Mounting Type: SurfaceMount,MLCC; Operating Temperature: –55 to 125°C; Series: GCM; Tolerance: ±10%; Manufacturer_Part_Number: GCM155R71H104KE02
C122 C124 C130 C145 = gen_C_ceramic_1u_25V_X7R_0603: Ceramic, 1.0µF, ±10%, 25V, X7R, –55 to 125°C, 0603 (1608),RoHS, Automotive; Part Number: GCJ188R71E105KA01; Manufacturer: Murata; Capacitance: 1µF; Case EIA: 0603; Case Metric: 1608; PnP Package: C_0603_10; PnP Value: 1.0µF/25V/X7R; Automotive Qualified: True; Rated Voltage: 25V; Dielectric: X7R; Supplier 1: Digi-Key; Supplier Part Number 1: 490-14409-1-ND; Height - Seated (Max): 0.8mm; Mounting Type: SurfaceMount,MLCC; Operating Temperature: –55 to 125°C; Series: GCJ; Tolerance: ±10%; Manufacturer_Part_Number: GCJ188R71E105KA01
C142 = gen_C_ceramic_100n_50V_X7R_0603: as C128 on sheet FPGA_SPI_interface; Rated Voltage: 50V; Dielectric: X7R; Supplier 1: Digi-Key; Supplier Part Number 1: 490-5798-1-ND; Height - Seated (Max): 0.8mm; Mounting Type: SurfaceMount,MLCC; Operating Temperature: –55 to 125°C; Series: GCJ; Tolerance: ±10%; Manufacturer_Part_Number: GCJ188R71H104KA12
C153 C157 = gen_C_ceramic_10n_50V_X7R_0603: Ceramic, 10nF, ±10%, 50V, X7R, –55 to 125°C, 0603 (1608),RoHS, Automotive; Part Number: GCJ188R71H102KA01; Manufacturer: Murata; Case EIA: 0603; Case Metric: 1608; Capacitance: 10n; Automotive Qualified: True; PnP Package: C_0603_10; PnP Value: 10nF/50V/X7R; Dielectric: X7R; Rated Voltage: 50V; Height - Seated (Max): 0.8mm; Mounting Type: SurfaceMount,MLCC; Operating Temperature: –55 to 125°C; Series: GCJ; Tolerance: ±10%; Manufacturer_Part_Number: GCJ188R71H102KA01; Supplier 1: Digi-Key; Supplier Part Number 1: 490-5768-1-ND
C159 C164 = gen_C_ceramic_100n_50V_X7R_0603: Ceramic, 100nF, ±10%, 50V, X7R, –55 to 125°C, 0603 (1608),RoHS, Automotive; Part Number: GCJ188R71H104KA12; Manufacturer: Murata; Capacitance: 100n; Case EIA: 0603; Case Metric: 1608; Automotive Qualified: True; PnP Package: C_0603_10; PnP Value: 100nF/50V/X7R; Dielectric: X7R; Rated Voltage: 50V; Height - Seated (Max): 0.8mm; Mounting Type: SurfaceMount,MLCC; Operating Temperature: –55 to 125°C; Series: GCJ; Tolerance: ±10%; Manufacturer_Part_Number: GCJ188R71H104KA12; Supplier 1: Digi-Key; Supplier Part Number 1: 490-5798-1-ND
D19 = DIODE_SCHTKY: BAT41 Schottky diode, small signal,SOD-523 package, RoHS compliant; DBDesc: do not populate, RoHS compliant; ID: 908; Preffered ID: 20995
L17 = CMP-0686-00649-2: Chip Ferrite Bead for General Signal lines, 470 Ohm, 700 mA, -55 to 125 degC, 2 x 1.25 x 1.05 mm SMD, Tape and Reel; Manufacturer: Murata; DC Resistance: 0.19 Ohm Max.; Impedance (at 100 MHz): 470 Ohm +/- 25%; Rated Current: 700 mA; ComponentLink1URL: http://www.murata.com/; Packing: Tape and Reel; PackageDescription: 2-Pin Chip, Body 2 x 1.25 mm; ComponentLink3Description: Package Specification; Operating Temperature Range: -55 to 125 degC; ComponentLink1Description: Manufacturer URL; PartNumber: BLM21AG471SN1J; DatasheetVersion: 08/2013; Mounting Technology: Surface Mount; ComponentLink2URL: http://www.murata.com/products/catalog/pdf/c31e.pdf; ComponentLink3URL: http://www.murata.com/products/catalog/pdf/c31e.pdf; ComponentLink2Description: Datasheet; PackageReference: BLM21_H1050-2; Part Number: BLM21AG471SN1J
R117 R119 R126 = gen_R_100k_0603: as R58 on sheet mcu0_primary; Operating Temperature: -55°C - +155°C; PnP Value: 100k; Part Number: gen_R_100k_0603
R129 = gen_R_10M_0603: SMD Resistor 10M 0603; Part Number: gen_R_10Meg_0603; Case EIA: 0603; Case Metric: 1608; PnP Package: R_0603; PnP Value: 10Meg; Automotive Qualified: False; Operating Temperature: -55°C - +155°C
R130 = gen_R_NF_0603: SMD Resistor NF 0603; Case EIA: 0603; Case Metric: 1608; PnP Package: R_0603; Automotive Qualified: False; Operating Temperature: -55°C - +155°C; Part Number: gen_R_NF_0603; PnP Value: NF
TPvBat1 TPvRef1 = Testpoint_Square: Testpoint, square; Part Number: Testpoint_Square
U26 = MC-ARM-STM32F4X9-SQ176: as U26 on sheet mcu0_primary; Core: ARM Cortex-M4; PackageReference: LQFP176; ComponentLink1Description: Manufacturer URL; Packing: Tray; ComponentLink2Description: Datasheet; ComponentLink3Description: Package Specification; ComponentLink2URL: http://www.st.com/st-web-ui/static/active/en/resource/technical/document/data_brief/DM00053488.pdf; PackageVersion: Rev. 4, 06/2013; ComponentLink1URL: http://www.st.com/web/en/home.html; DatasheetVersion: Rev. 2; PartNumber: STM32F429IIT6; PackageDescription: 176-Pin Low Profile Quad Flat Package, 24 x 24 mm Body, 0.5 mm Pitch; ComponentLink3URL: http://www.st.com/st-web-ui/static/active/en/resource/technical/document/datasheet/DM00035129.pdf; Mounting Technology: Surface Mount; Part Number: STM32F429IIT6
U33 = CMP-0784-00366-1: Micropower, High Accuracy Voltage Reference, 2.5 V Output, 2.7 to 5.5 V Supply, Industrial, 6-pin SOT23 (RJ-6), Reel; Manufacturer: Analog Devices; Vout: 2.5V; Ref Out TC (ppm/C): 2.5; Min V Supply (V): 2.7; Max V Supply (V): 5.5; ComponentLink3URL: http://www.analog.com/static/imported-files/packages/PKG_PDF/SOT-23(RJ)/RJ_6.pdf; Mounting Technology: Surface Mount; Packing: Reel; ComponentLink3Description: Package Specification; Code_JEDEC: MO-178-AB; PackageReference: RJ-6; Operating Temp Range: -40 to 125 degC; PartNumber: ADR3425ARJZ-R2; ComponentLink2Description: Datasheet; PackageDescription: 6-Pin Small Outline Transistor Package, Body 2.9 x 1.6 mm, Pitch 0.95 mm; ComponentLink1URL: http://www.analog.com/en/index.html; ComponentLink2URL: http://www.analog.com/static/imported-files/data_sheets/ADR3412_ADR3420_ADR3425_ADR3430_ADR3433_ADR3440_ADR3450.pdf; ComponentLink1Description: Manufacturer URL; PackageVersion: 121608-A, 12/2008; ComponentLink4URL: Product URL:http://www.analog.com/en/special-linear-functions/voltage-references/adr3425/products/product.html; ComponentLink4Description: URL Link1; DatasheetVersion: Rev. B; Part Number: ADR3425ARJZ-R2
U36 = LTC2990: ID: 19355; DBDesc: Linear LTC2990IMS quad I2C voltage, current and temperature monitor, -40°C to +85°C, 10-pin MSOP, RoHS compliant; Part Number: LTC2990
U40 = DS1339-U33: DBDesc: DS1339U-33+ RTC I2C w/alarm USOP-8, RoHS compliant; ID: 11376; Part Number: DS1339-U33
X15 = CRYSTAL1: ID: 22914; DBDesc: 32.768kHz ABS07-120, 20ppm, 6pF load, 60k ESR, 3.2x1.5mm crystal, RoHS compliant